# EAGLE design Hypera (EAGLE 7.7.0)
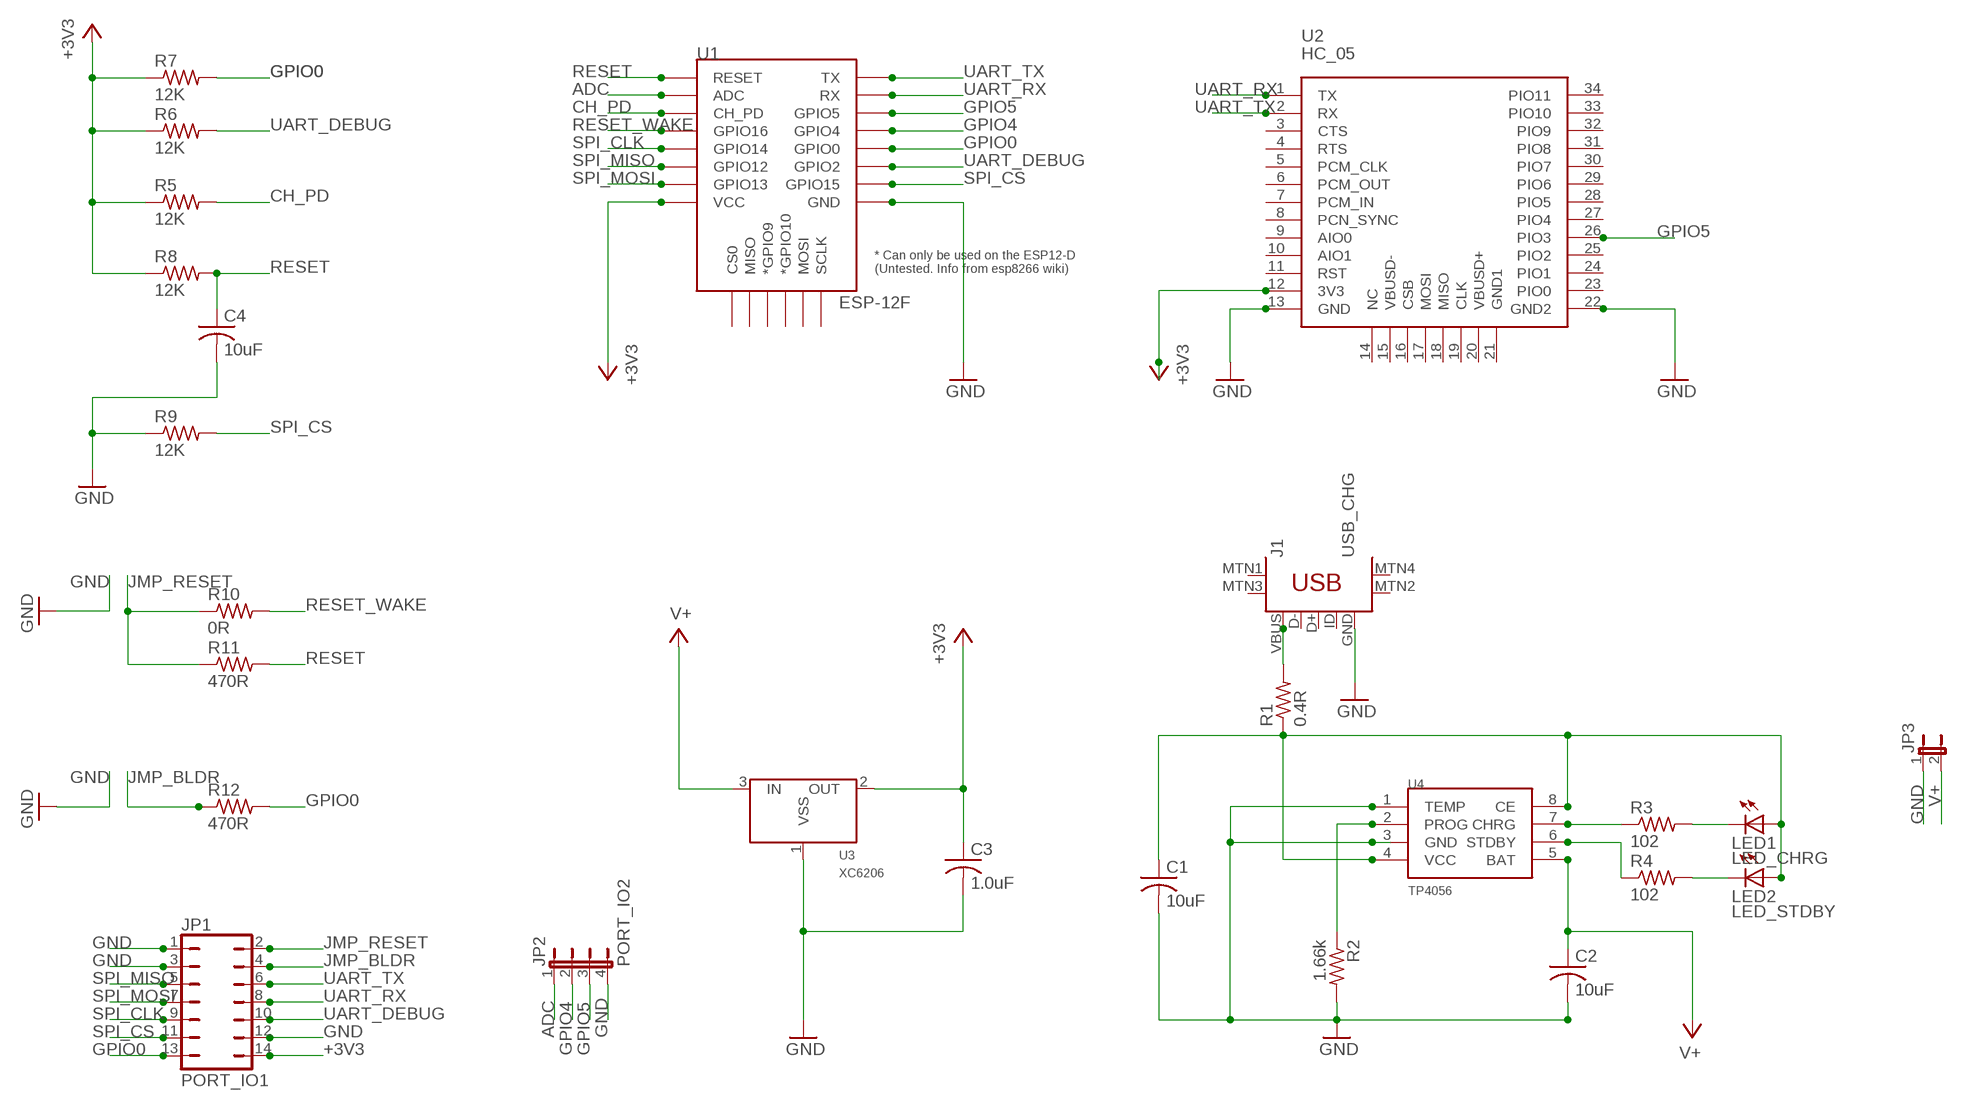
[diagram p0: schematic, sheet 1]

## Parts
C1  10uF  C-USC0805  [C0805]
C2  10uF  C-USC0805  [C0805]
C3  1.0uF  C-USC0805K  [C0805K]
C4  10uF  C-USC0805  [C0805]
J1  USB_CHG  USB-MINIB-5PIN  [USB-MINIB]
JP1  PORT_IO1  JP7Q  [JP7Q]
JP2  PORT_IO2  JP4E  [JP4]
JP3  JP1E  [JP1]
LED1  LED_CHRG  LEDCHIPLED_0805  [CHIPLED_0805]
LED2  LED_STDBY  LEDCHIPLED_0805  [CHIPLED_0805]
R1  0.4R  R-US_R1210  [R1210]
R2  1.66k  R-US_M0805  [M0805]
R3  102  R-US_M0805  [M0805]
R4  102  R-US_M0805  [M0805]
R5  12K  R-US_R0805  [R0805]
R6  12K  R-US_R0805  [R0805]
R7  12K  R-US_R0805  [R0805]
R8  12K  R-US_R0805  [R0805]
R9  12K  R-US_R0805  [R0805]
R10  0R  R-US_R0805  [R0805]
R11  470R  R-US_R0805  [R0805]
R12  470R  R-US_R0805  [R0805]
U1  ESP-12F  ESP12ESMD  [ESP12E-SMD]
U2  HC_05  [BLUETOOTH_SMD]
U3  XC6206  XC6206SOT-23  [XC6206_SOT-23]
U4  TP4056  [SOP-8]

## Nets
+3V3: C3.1 JP1.14 R5.1 R6.1 R7.1 R8.1 U1.VCC U2.12(3V3) U3.2(OUT)
ADC: JP2.1 U1.ADC
CH_PD: R5.2 U1.CH_PD
GND: C1.2 C2.2 C3.2 C4.2 J1.GND JP1.1 JP1.3 JP1.12 JP2.4 JP3.1 R2.2 R9.1 U1.GND U2.13(GND) U2.22(GND2) U3.1(VSS) U4.1(TEMP) U4.3(GND)
GPIO0: JP1.13 R7.2 R12.2 U1.GPIO0
GPIO4: JP2.2 U1.GPIO4
GPIO5: JP2.3 U1.GPIO5 U2.26(PIO3)
JMP_BLDR: JP1.4 R12.1
JMP_RESET: JP1.2 R10.1 R11.1
N$1: LED2.C R4.2
N$2: LED1.C R3.2
N$4: R4.1 U4.6(STDBY)
N$5: R3.1 U4.7(CHRG)
N$6: R2.1 U4.2(PROG)
N$10: C1.1 LED1.A LED2.A R1.1 U4.4(VCC) U4.8(CE)
N$22: J1.VBUS R1.2
RESET: C4.1 R8.2 R11.2 U1.RESET
RESET_WAKE: R10.2 U1.GPIO16
SPI_CLK: JP1.9 U1.GPIO14
SPI_CS: JP1.11 R9.2 U1.GPIO15
SPI_MISO: JP1.5 U1.GPIO12
SPI_MOSI: JP1.7 U1.GPIO13
UART_DEBUG: JP1.10 R6.2 U1.GPIO2
UART_RX: JP1.8 U1.RXD0(RX) U2.1(TX)
UART_TX: JP1.6 U1.TXD0(TX) U2.2(RX)
V+: C2.1 JP3.2 U3.3(IN) U4.5(BAT)
Unconnected: J1.D+ J1.D- J1.ID J1.MTN1(MTN2) J1.MTN2(MTN3) J1.MTN3(MTN1) J1.MTN4 U1.CS0 U1.GPIO9(*GPIO9) U1.GPIO10(*GPIO10) U1.MISO U1.MOSI U1.SCLK U2.3(CTS) U2.4(RTS) U2.5(PCM_CLK) U2.6(PCM_OUT) U2.7(PCM_IN) U2.8(PCN_SYNC) U2.9(AIO0) U2.10(AIO1) U2.11(RST) U2.14(NC) U2.15(VBUSD-) U2.16(CSB) U2.17(MOSI) U2.18(MISO) U2.19(CLK) U2.20(VBUSD+) U2.21(GND1) U2.23(PIO0) U2.24(PIO1) U2.25(PIO2) U2.27(PIO4) U2.28(PIO5) U2.29(PIO6) U2.30(PIO7) U2.31(PIO8) U2.32(PIO9) U2.33(PIO10) U2.34(PIO11)

## Library data of the parts
C1-C4 = resistor:C-US: CAPACITOR, American symbol
J1 = SparkFun-Connectors:USB-MINIB: Mini-USB "B" connector with 5th pin broken out. Created new symbol breaking out 5th "ID" pin in mini/micro USB connector spec. See: http://en.wikipedia.org/wiki/Mini_usb#Cables. Uses same footprint as 4-pin symbol. Also added pins to connect to mounting / shield pads if required (probably not generally needed as signals aren't shielded once they leave the connector).; PROD_ID: CONN-08193
JP1 = jumper:JP7Q: JUMPER
JP2 = jumper:JP4E: JUMPER
JP3 = jumper:JP1E: JUMPER
LED1 LED2 = adafruit:LED: LED OSRAM: - CHIPLED LG R971, LG N971, LY N971, LG Q971, LY Q971, LO R971, LY R971 LH N974, LH R974 LS Q976, LO Q976, LY Q976 LO Q996 - Hyper CHIPLED LW Q18S LB Q993, LB Q99A, LB R99A - SideLED LS A670, LO A670, LY A670, LG A670, LP A670 LB A673, LV A673, LT A673, LW A673 LH A674 LY A675 LS A676, LA A676, LO A676, LY A676, LW A676 LS A679, LY A679, LG A679 - Hyper Micro SIDELED® LS Y876, LA Y876, LO Y876, LY Y876 LT Y87S - SmartLED LW L88C, LW L88S LB L89C, LB L89S, LG L890 LS L89K, LO L89K, LY L89K LS L896, LA L896, LO L896, LY L896 - TOPLED LS T670, LO T670, LY T670, LG T670, LP T670 LSG T670, LSP T670, LSY T670, LOP T670, LYG T670 LG T671, LOG T671, LSG T671 LB T673, LV T673, LT T673, LW T673 LH T674 LS T676, LA T676, LO T676, LY T676, LB T676, LH T676, LSB T676, LW T676 LB T67C, LV T67C, LT T67C, LS T67K, LO T67K, LY T67K, LW E67C LS E67B, LA E67B, LO E67B, LY E67B, LB E67C, LV E67C, LT E67C LW T67C LS T679, LY T679, LG T679 LS T770, LO T770, LY T770, LG T770, LP T770 LB T773, LV T773, LT T773, LW T773 LH T774 LS E675, LA E675, LY E675, LS T675 LS T776, LA T776, LO T776, LY T776, LB T776 LHGB T686 LT T68C, LB T68C - Hyper Mini TOPLED® LB M676 - Mini TOPLED Santana® LG M470 LS M47K, LO M47K, LY M47K Source: http://www.osram.convergy.de/
R1-R4 = resistor:R-US_: RESISTOR, American symbol
R5-R12 = adafruit:R-US_: RESISTOR, American symbol
U1 = esp8266modules:ESP12E: ESP12E Module
U2 = Bluetooth HC-05:HC_05: HC-05 Bluetooth Module
U3 = Voltage Regulator:XC6206: XC6206P , linear regulator. Producted by TOREX.Co Store Information: EXCEL device corporation http://www.excel-d.com/access/index.html
U4 = TP4056:TP4056

## Board
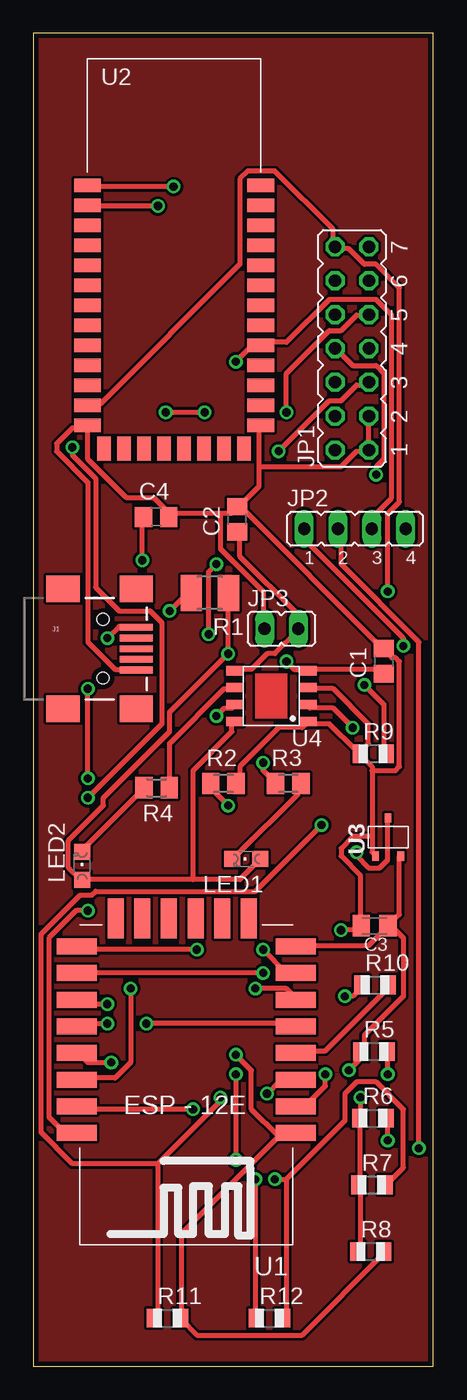
[diagram p1: board, top side]
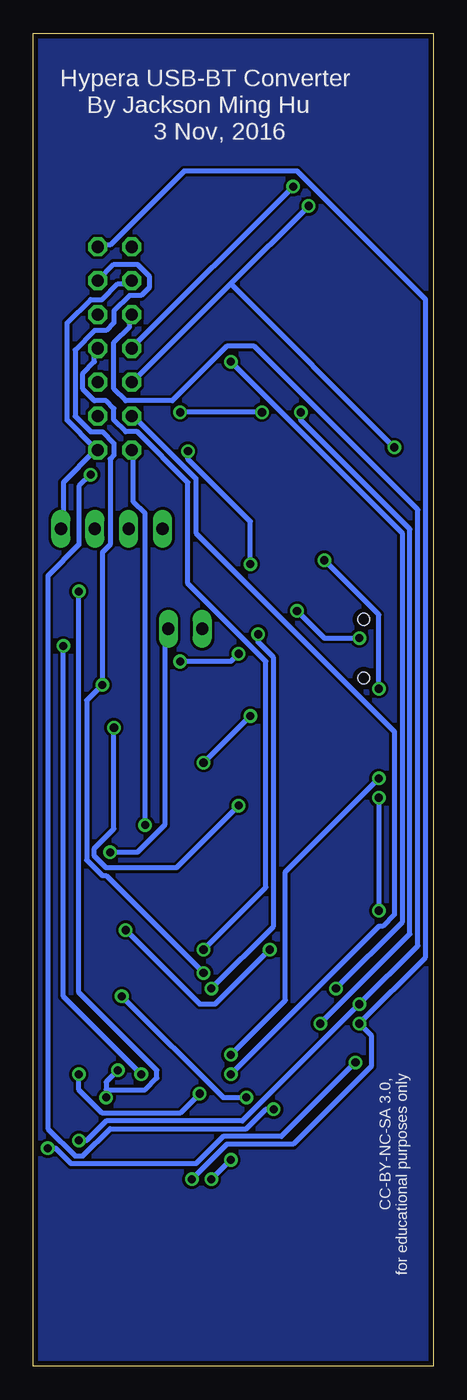
[diagram p2: board, bottom side, seen from below]

Size 30 x 100 mm. Coordinates in mm from the lower left corner, seen from the top.
Outline: 0,0 30,0 30,100 0,100 0,0
Copper layers (1*16): Top 0.035mm / dielectric 1.5mm / Bottom 0.035mm
Design rules "default *": minimum track width 15mil, minimum drill 24mil, track to track 8mil, track to pad 8mil, pad to pad 8mil, via to via 8mil, smd to smd 8mil, copper to edge 15mil, drill to drill 8mil, minimum pad ring 10mil, minimum via ring 8mil, stop-mask expansion 4mil, vias tented up to drill 10mil, thermal gap 10mil

### Footprints (pad centres in the part's own frame; a part is rotated, then mirrored left to right if it is on the bottom)
C0805 = smd 1.3 x 1.5: 1 -0.95,0; 2 0.95,0
C0805K = smd 1.3 x 1.6: 1 -1,0; 2 1,0
USB-MINIB = smd 2.5 x 0.5: D+ 2.5,0; D- 2.5,0.8; GND 2.5,-1.6; ID 2.5,-0.8; VBUS 2.5,1.6 | smd 2.5 x 2: MTN1 -3,4.5; MTN2 2.5,4.5; MTN3 -3,-4.5; MTN4 2.5,-4.5 | hole 0.9: 0,2.2; 0,-2.2
JP7Q = drill 0.914 octagon: 1 -7.62,-1.27; 2 -7.62,1.27; 3 -5.08,-1.27; 4 -5.08,1.27; 5 -2.54,-1.27; 6 -2.54,1.27; 7 0,-1.27; 8 0,1.27; 9 2.54,-1.27; 10 2.54,1.27; 11 5.08,-1.27; 12 5.08,1.27; 13 7.62,-1.27; 14 7.62,1.27
JP4 = drill 0.914 long: 1 -3.81,0; 2 -1.27,0; 3 1.27,0; 4 3.81,0
JP1 = drill 0.914 long: 1 0,-1.27; 2 0,1.27
CHIPLED_0805 = smd 1.2 x 1.2: A 0,-1.05; C 0,1.05
R1210 = smd 1.6 x 2.7: 1 -1.4,0; 2 1.4,0
M0805 = smd 1.3 x 1.6: 1 -0.95,0; 2 0.95,0
R0805 = smd 1.1 x 1.4: 1 -1,0; 2 1,0
ESP12E-SMD = smd 3 x 1.2: ADC -8.3,3.8; CH_PD -8.3,1.8; GND 8.1,-8.2; GPIO0 8.1,-2.2; GPIO2 8.1,-4.2; GPIO4 8.1,-0.2; GPIO5 8.1,1.8; GPIO12 -8.3,-4.2; GPIO13 -8.3,-6.2; GPIO14 -8.3,-2.2; GPIO15 8.1,-6.2; GPIO16 -8.3,-0.2; RESET -8.3,5.8; RXD0 8.1,3.8; TXD0 8.1,5.8; VCC -8.3,-8.2 | smd 1.2 x 3: CS0 -4.8,-10.3; GPIO9 -0.8,-10.3; GPIO10 1.2,-10.3; MISO -2.8,-10.3; MOSI 3.2,-10.3; SCLK 5.2,-10.3
BLUETOOTH_SMD = smd 2 x 1: 1 -6.35,3.81; 2 -6.35,2.31; 3 -6.35,0.81; 4 -6.35,-0.69; 5 -6.35,-2.19; 6 -6.35,-3.69; 7 -6.35,-5.19; 8 -6.35,-6.69; 9 -6.35,-8.19; 10 -6.35,-9.69; 11 -6.35,-11.19; 12 -6.35,-12.69; 13 -6.35,-14.19; 22 6.65,-14.19; 23 6.65,-12.69; 24 6.65,-11.19; 25 6.65,-9.69; 26 6.65,-8.19; 27 6.65,-6.69; 28 6.65,-5.19; 29 6.65,-3.69; 30 6.65,-2.19; 31 6.65,-0.69; 32 6.65,0.81; 33 6.65,2.31; 34 6.65,3.81 | smd 1 x 1.8: 14 -5.1,-15.94; 15 -3.6,-15.94; 16 -2.1,-15.94; 17 -0.6,-15.94; 18 0.9,-15.94; 19 2.4,-15.94; 20 3.9,-15.94; 21 5.4,-15.94
XC6206_SOT-23 = smd 0.5 x 0.7: 1 -0.95,-1.415; 2 0.95,-1.415; 3 0,1.44
SOP-8 = smd 1.3 x 0.7: 1 -2.75,1.905; 2 -2.75,0.635; 3 -2.75,-0.635; 4 -2.75,-1.905; 5 2.75,-1.905; 6 2.75,-0.635; 7 2.75,0.635; 8 2.75,1.905

### Placement (x,y rotation side)
C1  26.28,52.9 90 top
C2  15.28,63.55 90 top
C3  25.59,33.04 180 top
C4  9.2,63.72 0 top
J1  5.22,53.83 0 top
JP1  23.9,76.36 90 top
JP2  24.12,62.83 0 top
JP3  18.61,55.32 270 top
LED1  15.98,38.06 90 top
LED2  3.66,37.54 0 top
R1  13.24,58.01 180 top
R2  14.25,43.72 0 top
R3  19.12,43.72 0 top
R4  9.24,43.39 180 top
R5  25.55,23.61 0 top
R6  25.47,18.61 0 top
R7  25.39,13.61 0 top
R8  25.31,8.61 0 top
R9  25.49,45.96 0 top
R10  25.63,28.61 0 top
R11  10.06,3.61 0 top
R12  17.71,3.61 0 top
U1  11.37,23.3 180 top
U2  10.41,84.78 0 top
U3  26.6,39.69 0 top
U4  17.86,50.28 180 top

### Tracks (layer width: path | path; a pad name or v marks a point on that pad's centre or on a via)
+3V3  (via drill 0.61)
  Top 0.381: U2.12 4.09,72.15 4.97,72.15 15.48,82.66 15.48,89.09 16.07,89.67 18.11,89.67 22.49,85.29 22.49,84.12 JP1.14 22.78,83.83 23.66,83.83 24.83,82.66 25.7,82.66 27.46,80.91 27.46,64.85 26.58,63.97 v26.58,58.13 | R8.1 24.54,8.76 24.54,13.44 R7.1 24.54,13.73 24.54,18.4 R6.1 24.54,18.69 v24.54,20.16 | U3.2 27.46,38.27 27.46,33.88 26.87,33.3 C3.1 | C3.1 26.87,33.01 27.75,32.13 27.75,27.75 24.83,24.83 24.83,23.66 R5.1 24.83,23.37 v23.66,22.2 | U1.VCC 19.86,31.55 25.12,31.55 26.58,33.01 C3.1
  Bottom 0.381: 24.54,20.74 24.54,21.32 v23.66,22.2 | 24.54,20.74 v24.54,20.16 | v26.58,58.13 26.58,28.04 20.74,22.2 20.74,21.61 21.61,20.74 24.54,20.74
ADC  (via drill 0.61)
  Top 0.381: v27.75,54.04 27.75,54.62 20.45,61.92 20.45,62.8 JP2.1 | v21.91,21.91 21.91,21.03 20.45,19.57 19.86,19.57 U1.ADC
  Bottom 0.381: v27.75,54.04 27.75,27.75 v21.91,21.91
CH_PD  (via drill 0.61)
  Top 0.381: v26.58,21.91 26.58,23.37 R5.2 | v17.53,20.45 18.4,21.32 19.57,21.32 U1.CH_PD
  Bottom 0.381: v26.58,21.91 26.58,20.74 24.83,18.99 18.99,18.99 v17.53,20.45
GND  (via drill 0.61)
  Top 0.381: 25.41,44.69 25.41,44.98 24.54,45.86 R9.1 | 25.41,44.69 25.41,39.73 | 25.41,39.73 25.41,38.56 U3.1 | R9.1 24.24,46.15 22.2,48.2 20.74,48.2 U4.1 20.45,48.2 20.16,47.9 18.4,47.9 15.48,44.98 15.48,43.81 R2.2 | U4.3 20.74,50.83 22.49,50.83 25.12,48.2 25.12,46.74 24.54,46.15 R9.1 | 25.41,44.69 27.16,44.69 27.46,44.98 27.46,52.87 27.16,53.16 26.87,53.16 26.29,53.75 C1.2 26,54.04 15.48,64.55 | 25.41,39.73 23.95,39.73 23.08,38.85 23.08,38.27 24.54,36.8 24.54,33.3 C3.2 24.54,33.01 24.24,32.72 v23.08,32.72 | v12.27,31.25 3.5,31.25 U1.GND | JP1.3 25.12,71.27 25.12,68.94 JP1.1 25.12,68.64 24.24,68.64 23.08,67.47 16.94,67.47 | 14.02,63.97 14.9,63.97 15.19,64.26 C2.2 15.48,64.55 | 14.02,63.97 10.22,63.97 | 10.22,63.97 9.05,65.14 7.01,65.14 4.09,68.06 4.09,70.4 U2.13 3.8,70.4 2.92,70.4 1.75,69.23 1.75,68.64 4.09,66.31 4.09,54.33 6.13,52.29 7.59,52.29 J1.GND | 10.22,63.97 C4.2 | 16.94,67.47 16.94,66.02 15.48,64.55 | 16.94,67.47 16.94,70.4 U2.22 | 14.02,63.97 14.02,61.34 17.23,58.13 17.23,55.5 JP3.1
  Bottom 0.381: v12.27,31.25 16.36,27.16 17.53,27.16 v23.08,32.72 | JP2.4 27.75,63.09 27.75,66.31 25.41,68.64 JP1.1 25.41,68.94 27.46,70.98 27.46,78.28 25.7,80.03 24.83,80.03 23.66,81.2 22.78,81.2 JP1.12
GPIO0  (via drill 0.61)
  Top 0.381: 18.99,14.02 18.99,3.8 R12.2 | 18.99,14.02 23.37,18.4 23.37,20.45 24.24,21.32 25.7,21.32 27.75,19.28 27.75,14.9 26.58,13.73 R7.2 | v5.55,25.7 3.5,25.7 U1.GPIO0 | v18.11,14.02 18.99,14.02
  Bottom 0.381: JP1.13 25.12,84.12 24.24,84.12 18.69,89.67 10.22,89.67 0.58,80.03 0.58,30.67 v5.55,25.7 4.67,24.83 4.67,22.49 10.52,16.65 15.48,16.65 v18.11,14.02
GPIO4  (via drill 0.61)
  Top 0.381: v28.92,16.36 28.92,54.33 23.08,60.17 23.08,62.8 JP2.2 | v5.84,22.78 4.09,22.78 3.5,23.37 U1.GPIO4
  Bottom 0.381: v28.92,16.36 28.33,16.36 27.16,15.19 17.82,15.19 15.77,17.23 11.39,17.23 v5.84,22.78
GPIO5  (via drill 0.61)
  Top 0.381: JP2.3 25.41,63.09 25.41,63.68 26.87,65.14 26.87,78.87 25.7,80.03 22.2,80.03 18.99,76.82 17.23,76.82 U2.26 16.94,76.53 16.36,76.53 v15.19,75.36 | v7.3,28.33 7.3,22.78 6.13,21.61 3.5,21.61 U1.GPIO5
  Bottom 0.381: v7.3,28.33 2.34,33.3 2.34,62.51 v15.19,75.36
JMP_BLDR  (via drill 0.61)
  Top 0.381: v16.65,14.02 16.65,3.8 R12.1 | v15.19,21.91 v15.19,15.48
  Bottom 0.381: v15.19,15.48 v16.65,14.02 | v15.19,21.91 4.09,33.01 3.8,33.01 2.92,33.88 2.92,47.61 17.82,62.51 17.82,66.6 22.49,71.27 JP1.4
JMP_RESET  (via drill 0.61)
  Top 0.381: 9.35,15.19 9.35,3.8 R11.1 | 9.35,15.19 14.02,19.86 v14.02,20.16 | v23.37,27.75 23.95,27.75 24.54,28.33 R10.1 | v21.61,40.6 16.65,35.64 4.67,35.64 4.38,35.34 3.5,35.34 0.58,32.42 0.58,17.53 2.92,15.19 9.35,15.19
  Bottom 0.381: v14.02,20.16 15.77,20.16 v23.37,27.75 | v21.61,40.6 21.61,63.97 22.49,64.85 22.49,68.64 JP1.2
N$1
  Top 0.381: LED2.C 3.8,38.85 8.18,43.23 R4.2
N$2
  Top 0.381: LED1.C 15.19,38.27 19.86,42.94 19.86,43.52 R3.2
N$3
  pour Bottom: 0,100 30,100 30,0 0,0
N$4
  Top 0.381: U4.6 14.9,50.83 14.31,50.83 10.22,46.74 10.22,43.52 R4.1
N$5  (via drill 0.61)
  Top 0.381: v13.73,48.78 14.31,49.37 14.9,49.37 U4.7 | v17.23,45.28 17.23,44.69 18.11,43.81 R3.1
  Bottom 0.381: v17.23,45.28 v13.73,48.78
N$6  (via drill 0.61)
  Top 0.381: v23.95,47.9 22.49,49.37 20.74,49.37 U4.2 | v14.61,42.06 13.14,43.52 R2.1
  Bottom 0.381: v23.95,47.9 23.95,40.31 25.41,38.85 25.41,38.27 24.54,37.39 19.28,37.39 v14.61,42.06
N$7
  pour Top: 0,100 30,100 30,0 0,0
N$10  (via drill 0.61)
  Top 0.381: C1.1 26,51.99 25.7,52.29 20.74,52.29 U4.4 20.45,52.29 19.57,52.29 v18.99,52.87 | 11.98,36.51 15.48,36.51 16.94,37.97 LED1.A | 11.98,36.51 3.8,36.51 LED2.A 3.5,36.51 2.63,37.39 2.63,39.43 5.26,42.06 5.26,42.65 10.22,47.61 10.22,49.07 v14.61,53.45 14.61,57.84 R1.1 | 11.98,36.51 11.98,44.69 14.9,47.61 14.9,48.2 U4.8
  Bottom 0.381: v18.99,52.87 15.19,52.87 v14.61,53.45
N$22  (via drill 0.61)
  Top 0.381: v5.55,54.62 6.43,55.5 7.59,55.5 J1.VBUS | v10.22,56.67 11.68,58.13 R1.2
  Bottom 0.381: v5.55,54.62 8.18,54.62 v10.22,56.67
RESET  (via drill 0.61)
  Top 0.381: 18.4,17.23 11.1,9.93 11.1,3.8 R11.2 11.1,3.5 12.27,2.34 20.16,2.34 26.29,8.47 R8.2 | 18.4,17.23 19.57,17.23 U1.RESET 18.4,17.23 | v8.18,60.47 8.18,63.68 C4.1 | v4.09,44.11 v4.09,50.83 | v15.19,23.37 16.36,22.2 16.36,19.28 18.4,17.23
  Bottom 0.381: v8.18,60.47 4.09,56.38 v4.09,50.83 | v4.09,44.11 11.1,37.1 11.1,27.46 v15.19,23.37
RESET_WAKE
  Top 0.381: R10.2 26.58,28.33 21.91,23.66 19.86,23.66 U1.GPIO16
SPI_CLK  (via drill 0.61)
  Top 0.381: v18.99,71.56 18.99,74.49 22.2,77.7 23.08,77.7 24.24,78.87 25.12,78.87 JP1.9 | v9.93,71.56 v12.85,71.56 | v8.47,25.7 19.57,25.7 U1.GPIO14
  Bottom 0.381: v12.85,71.56 v18.99,71.56 | v9.93,71.56 9.93,70.98 1.75,62.8 1.75,32.42 v8.47,25.7
SPI_CS  (via drill 0.61)
  Top 0.381: v24.83,51.12 26.29,49.66 26.29,46.15 R9.2 | v17.23,29.5 3.5,29.5 U1.GPIO15
  Bottom 0.381: JP1.11 25.12,81.5 23.95,82.66 22.2,82.66 21.32,81.79 21.32,80.91 21.91,80.33 22.78,80.33 23.95,79.16 23.95,78.28 24.54,77.7 25.41,77.7 26.87,76.24 26.87,71.27 25.7,70.1 24.83,70.1 23.95,69.23 23.95,68.35 24.24,68.06 24.24,61.63 24.83,61.05 v24.83,51.12 26,49.95 26,37.97 24.83,36.8 24.54,36.8 v17.23,29.5
SPI_MISO  (via drill 0.61)
  Top 0.381: v18.4,68.64 22.2,72.44 23.08,72.44 24.24,73.61 25.12,73.61 JP1.5 | v13.73,60.17 13.14,59.59 v13.14,54.91 | v16.65,28.33 18.99,28.33 19.57,27.75 U1.GPIO12
  Bottom 0.381: v18.4,68.64 18.4,68.06 13.73,63.39 v13.73,60.17 | v13.14,54.91 13.14,54.33 11.98,53.16 11.98,33.01 v16.65,28.33
SPI_MOSI  (via drill 0.61)
  Top 0.381: v17.23,31.25 18.99,29.5 19.57,29.5 U1.GPIO13
  Bottom 0.381: v17.23,31.25 12.56,35.93 12.56,52.87 18.4,58.71 18.4,66.31 22.2,70.1 23.08,70.1 23.95,70.98 23.95,71.86 24.54,72.44 25.41,72.44 26.29,73.32 26.29,74.49 25.41,75.36 25.41,76.24 JP1.7
UART_DEBUG  (via drill 0.61)
  Top 0.381: v26.58,16.94 26.58,18.4 R6.2 | v5.55,27.16 3.8,27.16 3.5,27.46 U1.GPIO2
  Bottom 0.381: v26.58,16.94 26,16.94 24.54,18.4 14.31,18.4 v5.55,27.16 1.17,31.55 1.17,64.26 13.44,76.53 15.48,76.53 19.57,72.44 23.08,72.44 23.95,73.32 23.95,76.82 22.78,77.99 22.78,78.87 JP1.10
UART_RX  (via drill 0.61)
  Top 0.381: v10.52,88.51 4.09,88.51 U2.1 | v11.98,19.28 3.5,19.28 U1.RXD0 | v25.7,66.89 25.7,67.47 26.29,68.06 26.29,74.49 25.7,75.07 23.95,75.07 22.78,76.24 JP1.8
  Bottom 0.381: v10.52,88.51 22.49,76.53 JP1.8 | v11.98,19.28 12.56,19.28 14.02,17.82 24.24,17.82 26.29,15.77 26.87,15.77 28.92,17.82 28.92,59.3 26.58,61.63 26.58,66.02 v25.7,66.89
UART_TX  (via drill 0.61)
  Top 0.381: v9.35,87.05 4.09,87.05 U2.2 | v4.09,34.18 3.21,34.18 1.17,32.13 1.17,18.69 2.34,17.53 3.21,17.53 U1.TXD0 | v4.09,42.65 9.64,48.2 9.64,55.79 8.76,56.67 6.43,56.67 4.67,58.42 4.67,66.6 2.92,68.35 v2.92,68.94
  Bottom 0.381: 15.19,81.2 22.49,73.9 JP1.6 | 15.19,81.2 v9.35,87.05 | v4.09,42.65 v4.09,34.18 | 15.19,81.2 v2.92,68.94
V+  (via drill 0.61)
  Top 0.381: v24.24,38.56 24.24,38.27 25.12,37.39 26,37.39 26.58,37.97 26.58,40.89 U3.3 | U4.5 15.19,52.29 16.36,52.29 17.53,53.45 18.11,53.45 19.86,55.21 JP3.2 19.86,55.5 19.86,56.38 15.48,60.76 15.48,62.51 C2.1
  Bottom 0.381: v24.24,38.56 22.2,38.56 20.16,40.6 20.16,55.21 JP3.2

### Text on the board
bPlace: Hypera USB-BT Converter | By Jackson Ming Hu | 3 Nov, 2016 | CC-BY-NC-SA 3.0, / for educational purposes only